# Altium schematic sheet CANOPi_Topboard_Pi.SchDoc
size A3; DocumentNumber: 1; SheetNumber: 1; SheetTotal: 2; CopyrightYear: 2021
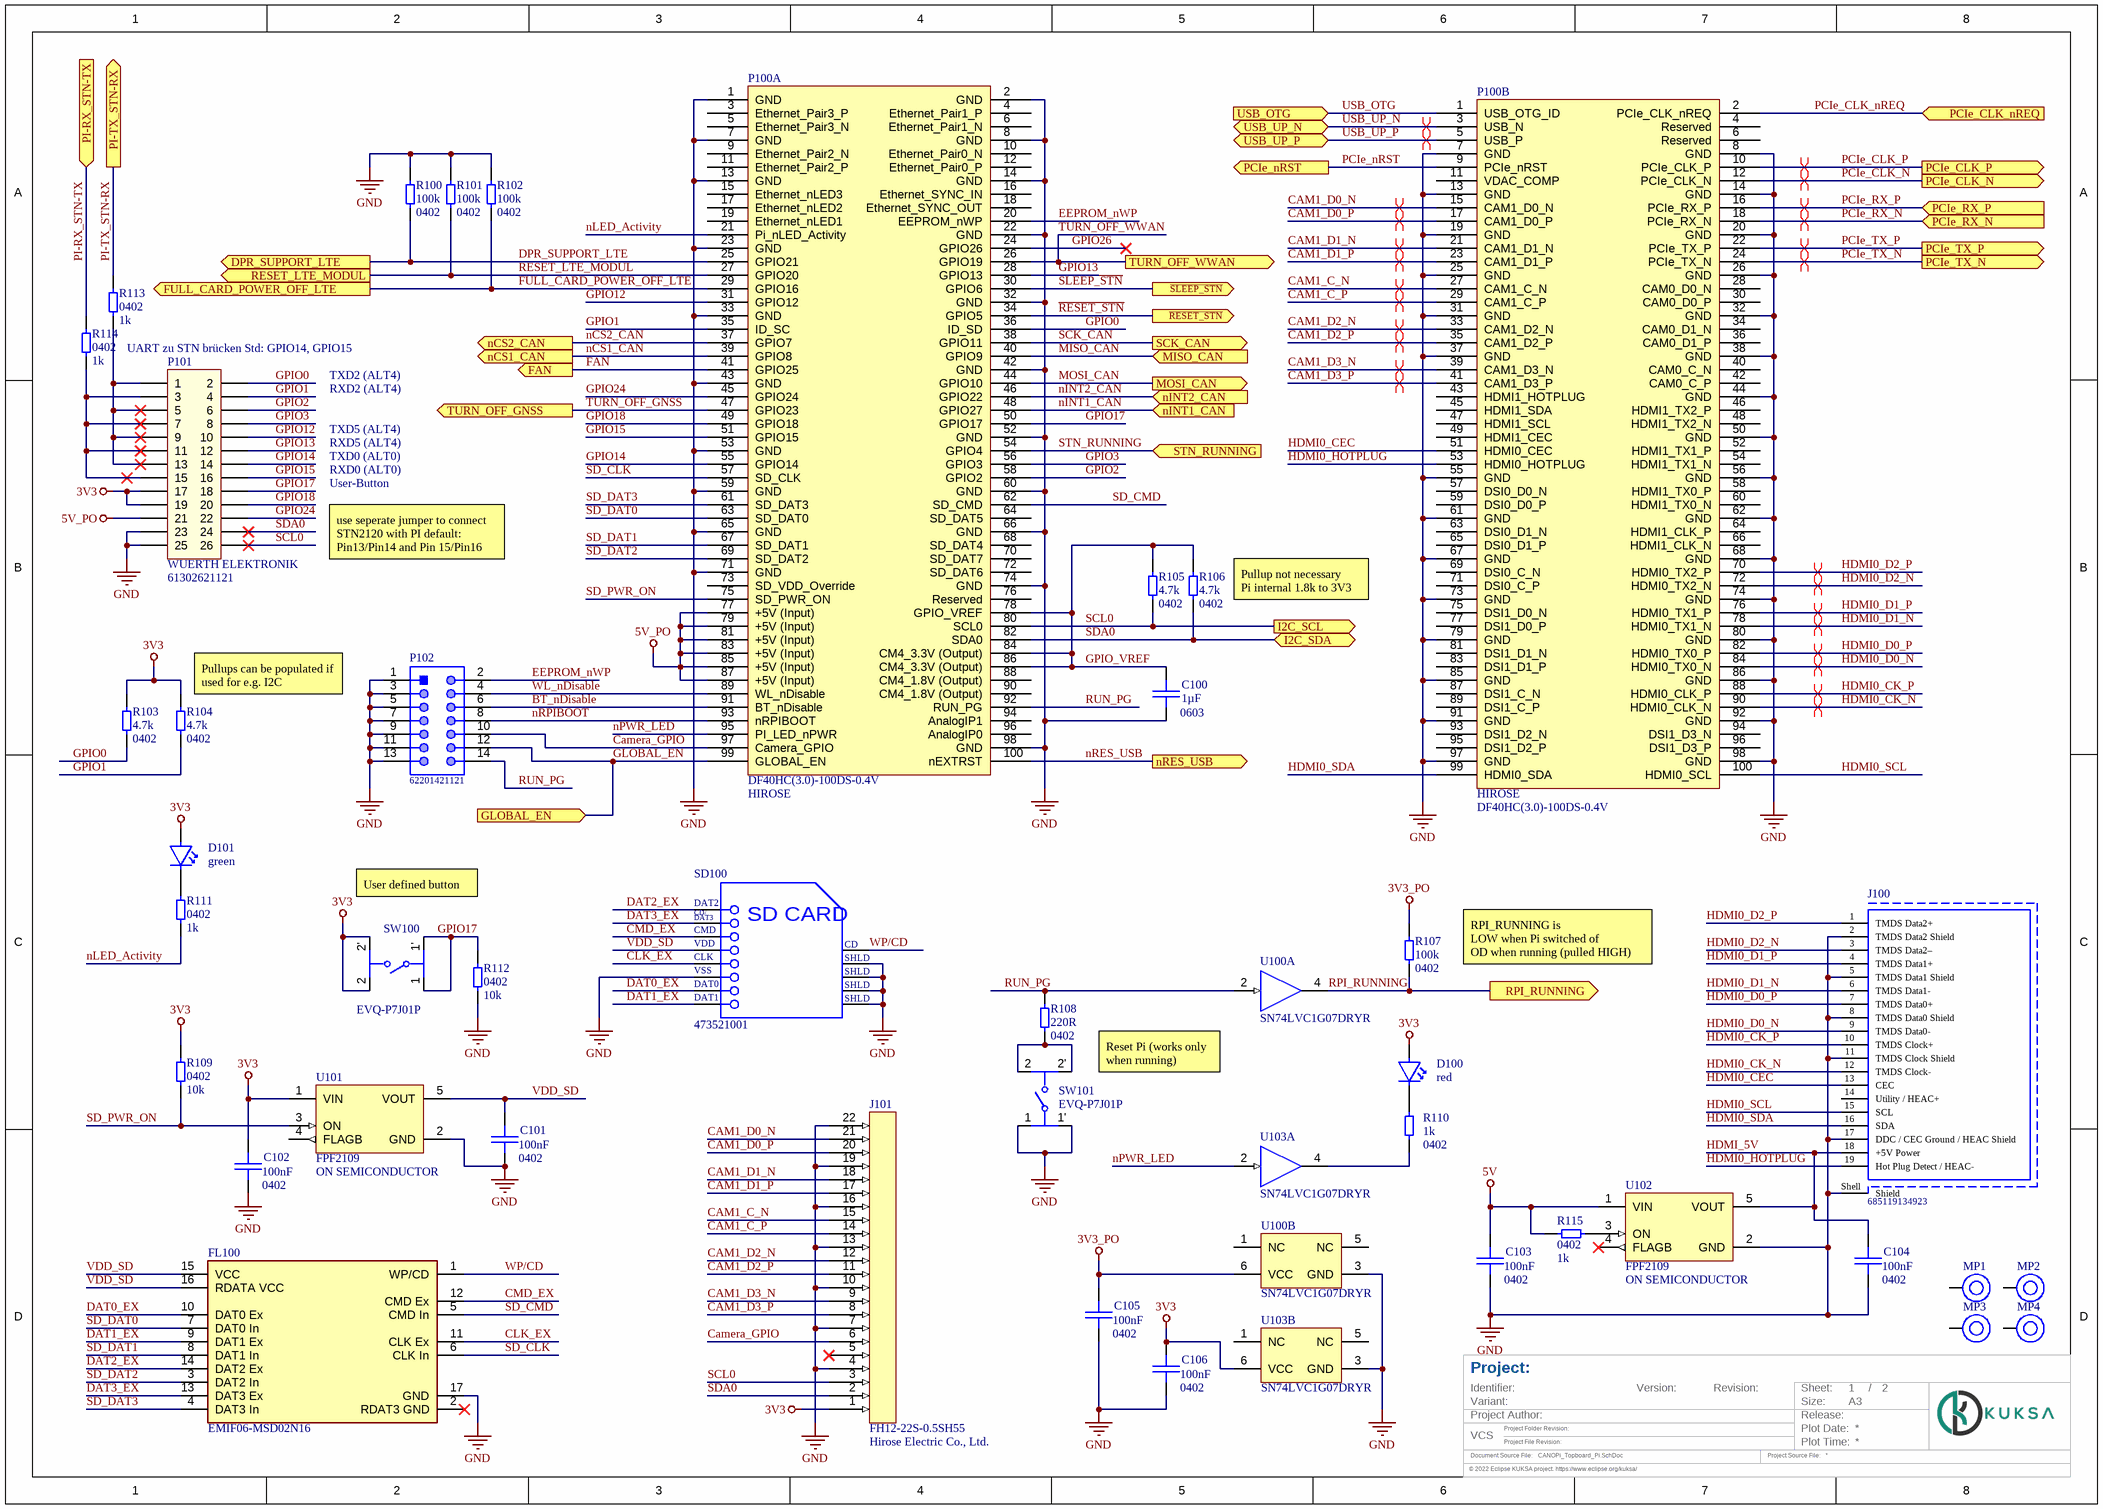
[diagram p0: CANOPi_Topboard_Pi.SchDoc]

## Parts
C100  Capacitance: 1µF  Case: 0603  [CAP 0603 [1608 Metric] X080 N]  (hidden comment: CAP 0603 1u -10% +10% 10V X7R)
C101  Capacitance: 100nF  Case: 0402  [CAP 0402 [1005 Metric] X050 N]  (hidden comment: CAP 0402 100n -10% +10% 6.3V X7R)
C102  Capacitance: 100nF  Case: 0402  [CAP 0402 [1005 Metric] X050 N]  (hidden comment: CAP 0402 100n -10% +10% 6.3V X7R)
C103  Capacitance: 100nF  Case: 0402  [CAP 0402 [1005 Metric] X050 N]  (hidden comment: CAP 0402 100n -10% +10% 6.3V X7R)
C104  Capacitance: 100nF  Case: 0402  [CAP 0402 [1005 Metric] X050 N]  (hidden comment: CAP 0402 100n -10% +10% 6.3V X7R)
C105  Capacitance: 100nF  Case: 0402  [CAP 0402 [1005 Metric] X050 N]  (hidden comment: CAP 0402 100n -10% +10% 6.3V X7R)
C106  Capacitance: 100nF  Case: 0402  [CAP 0402 [1005 Metric] X050 N]  (hidden comment: CAP 0402 100n -10% +10% 6.3V X7R)
D100  Colour LED1: red  [WUERTH ELEKTRONIK - WL-SMSW]  (hidden comment: WUERTH ELEKTRONIK - 155124RS73200)
D101  Colour LED1: green  [WUERTH ELEKTRONIK - WL-SMSW]  (hidden comment: WUERTH ELEKTRONIK - 155124VS73200)
FL100  EMIF06-MSD02N16  [FP-EMIF06-MSD02N16-MFG]
J100  685119134923  [685119134923]
J101  Manufacturer Part Number: FH12-22S-0.5SH55  Manufacturer: Hirose Electric Co., Ltd.  [HIROSE - FH12-22S-0.5SH55-Footprint-1]  (hidden comment: HIROSE - FH12-22S-0.5SH55)
MP1  WUERTH ELEKTRONIK - 9774030151  [WUERTH ELEKTRONIK - 9774030151]  (value not drawn)
MP2  WUERTH ELEKTRONIK - 9774030151  [WUERTH ELEKTRONIK - 9774030151]  (value not drawn)
MP3  WUERTH ELEKTRONIK - 9774030151  [WUERTH ELEKTRONIK - 9774030151]  (value not drawn)
MP4  WUERTH ELEKTRONIK - 9774030151  [WUERTH ELEKTRONIK - 9774030151]  (value not drawn)
P100A  Manufacturer Part Number: DF40HC(3.0)-100DS-0.4V  Manufacturer: HIROSE  [HIROSE - DF40HC(3.0)-100DS-0.4V]  (hidden comment: RASPBERRY-PI - Compute Modul 4)
P100B  Manufacturer: HIROSE  Manufacturer Part Number: DF40HC(3.0)-100DS-0.4V  [HIROSE - DF40HC(3.0)-100DS-0.4V]  (hidden comment: RASPBERRY-PI - Compute Modul 4)
P101  Manufacturer: WUERTH ELEKTRONIK  Manufacturer Part Number: 61302621121  [WUERTH ELEKTRONIK - 61302621121]  (hidden comment: WUERTH ELEKTRONIK - 61302621121)
P102  62201421121  [62201421121]
R100  Resistance: 100k  Case: 0402  [RES 0402 [1005 Metric]_N]  (hidden comment: RES 0402 100K 1% 0W0625)
R101  Resistance: 100k  Case: 0402  [RES 0402 [1005 Metric]_N]  (hidden comment: RES 0402 100K 1% 0W0625)
R102  Resistance: 100k  Case: 0402  [RES 0402 [1005 Metric]_N]  (hidden comment: RES 0402 100K 1% 0W0625)
R103  Resistance: 4.7k  Case: 0402  [RES 0402 [1005 Metric]_N]  (hidden comment: RES 0402 4K7 1% 0W0625)
R104  Resistance: 4.7k  Case: 0402  [RES 0402 [1005 Metric]_N]  (hidden comment: RES 0402 4K7 1% 0W0625)
R105  Resistance: 4.7k  Case: 0402  [RES 0402 [1005 Metric]_N]  (hidden comment: RES 0402 4K7 1% 0W0625)
R106  Resistance: 4.7k  Case: 0402  [RES 0402 [1005 Metric]_N]  (hidden comment: RES 0402 4K7 1% 0W0625)
R107  Resistance: 100k  Case: 0402  [RES 0402 [1005 Metric]_N]  (hidden comment: RES 0402 100K 1% 0W0625)
R108  Resistance: 220R  Case: 0402  [RES 0402 [1005 Metric]_N]  (hidden comment: RES 0402 220R 1% 0W0625)
R109  Case: 0402  Resistance: 10k  [RES 0402 [1005 Metric]_N]  (hidden comment: RES 0402 10K 1% 0W0625)
R110  Case: 0402  Resistance: 1k  [RES 0402 [1005 Metric]_N]  (hidden comment: RES 0402 1K 1% 0W0625)
R111  Case: 0402  Resistance: 1k  [RES 0402 [1005 Metric]_N]  (hidden comment: RES 0402 1K 1% 0W0625)
R112  Case: 0402  Resistance: 10k  [RES 0402 [1005 Metric]_N]  (hidden comment: RES 0402 10K 1% 0W0625)
R113  Case: 0402  Resistance: 1k  [RES 0402 [1005 Metric]_N]  (hidden comment: RES 0402 1K 1% 0W0625)
R114  Case: 0402  Resistance: 1k  [RES 0402 [1005 Metric]_N]  (hidden comment: RES 0402 1K 1% 0W0625)
R115  Case: 0402  Resistance: 1k  [RES 0402 [1005 Metric]_N]  (hidden comment: RES 0402 1K 1% 0W0625)
SD100  473521001  [MOLX-473521001_V]
SW100  EVQ-P7J01P  [FP-EVQ-P7J01P-MFG]
SW101  EVQ-P7J01P  [FP-EVQ-P7J01P-MFG]
U100  SN74LVC1G07DRYR  [DRY0006A_V]  (parts A,B of 2)
U101  Manufacturer Part Number: FPF2109  Manufacturer: ON SEMICONDUCTOR  [ON SEMICONDUCTOR - SOT-23, 5 Lead  CASE 527AH-01]  (hidden comment: ON SEMICONDUCTOR - FPF2109)
U102  Manufacturer Part Number: FPF2109  Manufacturer: ON SEMICONDUCTOR  [ON SEMICONDUCTOR - SOT-23, 5 Lead  CASE 527AH-01]  (hidden comment: ON SEMICONDUCTOR - FPF2109)
U103  SN74LVC1G07DRYR  [DRY0006A_V]  (parts A,B of 2)

## Ports
DPR_SUPPORT_LTE (out), FAN (out), FULL_CARD_POWER_OFF_LTE (out), GLOBAL_EN (in), I2C_SCL (out), I2C_SDA (bidir), MISO_CAN (in), MOSI_CAN (out), nCS1_CAN (out), nCS2_CAN (out), nINT1_CAN (in), nINT2_CAN (in), nRES_USB (out), PCIe_CLK_N (out), PCIe_CLK_nREQ (in), PCIe_CLK_P (out), PCIe_nRST (out), PCIe_RX_N (in), PCIe_RX_P (in), PCIe_TX_N (out), PCIe_TX_P (out), PI-RX_STN-TX (in), PI-TX_STN-RX (out), RESET_LTE_MODUL (out), RPI_RUNNING (out), SCK_CAN (out), STN_RUNNING (in), TURN_OFF_GNSS (out), TURN_OFF_WWAN (out), USB_OTG (in), USB_UP_N (bidir), USB_UP_P (bidir), ~{RESET_STN} (out), ~{SLEEP_STN} (out)

## Nets
3V3: C102.2 C106.2 D100.A D101.A J101.1 P101.17 P101.19 R103.2 R104.2 R109.1 SW100.2 SW100.2' U101.1(VIN) U103.6(VCC)
3V3_PO: C105.2 R107.2 U100.6(VCC)
5V: C103.2 R115.2 U102.1(VIN)
5V_PO: P100A.77(+5V_(Input)) P100A.79(+5V_(Input)) P100A.81(+5V_(Input)) P100A.83(+5V_(Input)) P100A.85(+5V_(Input)) P100A.87(+5V_(Input)) P101.21
GND: C100.2 C101.1 C102.1 C103.1 C104.1 C105.1 C106.1 FL100.17(GND) J100.2(TMDS_Data2_Shield) J100.5(TMDS_Data1_Shield) J100.8(TMDS_Data0_Shield) J100.11(TMDS_Clock_Shield) J100.17(DDC_/_CEC_Ground_/_HEAC_Shield) J100.Shell(Shield) J101.4 J101.7 J101.10 J101.13 J101.16 J101.19 J101.22 P100A.1(GND) P100A.2(GND) P100A.7(GND) P100A.8(GND) P100A.13(GND) P100A.14(GND) P100A.22(GND) P100A.23(GND) P100A.32(GND) P100A.33(GND) P100A.42(GND) P100A.43(GND) P100A.52(GND) P100A.53(GND) P100A.59(GND) P100A.60(GND) P100A.65(GND) P100A.66(GND) P100A.71(GND) P100A.74(GND) P100A.98(GND) P100B.7(GND) P100B.8(GND) P100B.13(GND) P100B.14(GND) P100B.19(GND) P100B.20(GND) P100B.25(GND) P100B.26(GND) P100B.31(GND) P100B.32(GND) P100B.37(GND) P100B.38(GND) P100B.44(GND) P100B.50(GND) P100B.55(GND) P100B.56(GND) P100B.61(GND) P100B.62(GND) P100B.67(GND) P100B.68(GND) P100B.73(GND) P100B.74(GND) P100B.79(GND) P100B.80(GND) P100B.85(GND) P100B.86(GND) P100B.91(GND) P100B.92(GND) P100B.97(GND) P100B.98(GND) P101.23 P101.25 P102.1 P102.3 P102.5 P102.7 P102.9 P102.11 P102.13 R100.2 R101.2 R102.2 R112.2 SD100.6(VSS) SD100.10(SHLD) SD100.11(SHLD) SD100.12(SHLD) SD100.13(SHLD) SW101.1 SW101.1' U100.3(GND) U101.2(GND) U102.2(GND) U103.3(GND)
~{RESET_STN}: P100A.34(GPIO5) ; port ~{RESET_STN}
~{SLEEP_STN}: P100A.30(GPIO6) ; port ~{SLEEP_STN}
BT_nDisable: P100A.91(BT_nDisable) P102.6
CAM1_C_N: J101.15 P100B.27(CAM1_C_N)
CAM1_C_P: J101.14 P100B.29(CAM1_C_P)
CAM1_D0_N: J101.21 P100B.15(CAM1_D0_N)
CAM1_D0_P: J101.20 P100B.17(CAM1_D0_P)
CAM1_D1_N: J101.18 P100B.21(CAM1_D1_N)
CAM1_D1_P: J101.17 P100B.23(CAM1_D1_P)
CAM1_D2_N: J101.12 P100B.33(CAM1_D2_N)
CAM1_D2_P: J101.11 P100B.35(CAM1_D2_P)
CAM1_D3_N: J101.9 P100B.39(CAM1_D3_N)
CAM1_D3_P: J101.8 P100B.41(CAM1_D3_P)
Camera_GPIO: J101.6 P100A.97(Camera_GPIO) P102.10
CLK_EX: FL100.11(CLK_Ex) SD100.5(CLK)
CMD_EX: FL100.12(CMD_Ex) SD100.3(CMD)
DAT0_EX: FL100.10(DAT0_Ex) SD100.7(DAT0)
DAT1_EX: FL100.9(DAT1_Ex) SD100.8(DAT1)
DAT2_EX: FL100.14(DAT2_Ex) SD100.1(DAT2)
DAT3_EX: FL100.13(DAT3_Ex) SD100.2(CD/DAT3)
DPR_SUPPORT_LTE: P100A.25(GPIO21) R100.1 ; port DPR_SUPPORT_LTE
EEPROM_nWP: P100A.20(EEPROM_nWP) P102.2
FAN: P100A.41(GPIO25) ; port FAN
FULL_CARD_POWER_OFF_LTE: P100A.29(GPIO16) R102.1 ; port FULL_CARD_POWER_OFF_LTE
GLOBAL_EN: P100A.99(GLOBAL_EN) P102.12 ; port GLOBAL_EN
GPIO0: P100A.36(ID_SD) P101.2 R103.1
GPIO1: P100A.35(ID_SC) P101.4 R104.1
GPIO2: P100A.58(GPIO2) P101.6
GPIO3: P100A.56(GPIO3) P101.8
GPIO12: P100A.31(GPIO12) P101.10
GPIO13: P100A.28(GPIO13) P101.12
GPIO14: P100A.55(GPIO14) P101.14
GPIO15: P100A.51(GPIO15) P101.16
GPIO17: P100A.50(GPIO17) P101.18 R112.1 SW100.1 SW100.1'
GPIO18: P100A.49(GPIO18) P101.20
GPIO24: P100A.45(GPIO24) P101.22
GPIO26: P100A.24(GPIO26)
GPIO_VREF: C100.1 P100A.78(GPIO_VREF) P100A.84(CM4_3.3V_(Output)) P100A.86(CM4_3.3V_(Output)) R105.2 R106.2
HDMI0_CEC: J100.13(CEC) P100B.51(HDMI0_CEC)
HDMI0_CK_N: J100.12(TMDS_Clock-) P100B.90(HDMI0_CLK_N)
HDMI0_CK_P: J100.10(TMDS_Clock+) P100B.88(HDMI0_CLK_P)
HDMI0_D0_N: J100.9(TMDS_Data0-) P100B.84(HDMI0_TX0_N)
HDMI0_D0_P: J100.7(TMDS_Data0+) P100B.82(HDMI0_TX0_P)
HDMI0_D1_N: J100.6(TMDS_Data1-) P100B.78(HDMI0_TX1_N)
HDMI0_D1_P: J100.4(TMDS_Data1+) P100B.76(HDMI0_TX1_P)
HDMI0_D2_N: J100.3(TMDS_Data2–) P100B.72(HDMI0_TX2_N)
HDMI0_D2_P: J100.1(TMDS_Data2+) P100B.70(HDMI0_TX2_P)
HDMI0_HOTPLUG: J100.19(Hot_Plug_Detect_/_HEAC-) P100B.53(HDMI0_HOTPLUG)
HDMI0_SCL: J100.15(SCL) P100B.100(HDMI0_SCL)
HDMI0_SDA: J100.16(SDA) P100B.99(HDMI0_SDA)
HDMI_5V: C104.2 J100.18(+5V_Power) U102.5(VOUT)
MISO_CAN: P100A.40(GPIO9) ; port MISO_CAN
MOSI_CAN: P100A.44(GPIO10) ; port MOSI_CAN
nCS1_CAN: P100A.39(GPIO8) ; port nCS1_CAN
nCS2_CAN: P100A.37(GPIO7) ; port nCS2_CAN
nINT1_CAN: P100A.48(GPIO27) ; port nINT1_CAN
nINT2_CAN: P100A.46(GPIO22) ; port nINT2_CAN
nLED_Activity: P100A.21(Pi_nLED_Activity) R111.1
nPWR_LED: P100A.95(PI_LED_nPWR) U103.2(A)
nRES_USB: P100A.100(nEXTRST) ; port nRES_USB
nRPIBOOT: P100A.93(nRPIBOOT) P102.8
PCIe_CLK_N: P100B.12(PCIe_CLK_N) ; port PCIe_CLK_N
PCIe_CLK_nREQ: P100B.2(PCIe_CLK_nREQ) ; port PCIe_CLK_nREQ
PCIe_CLK_P: P100B.10(PCIe_CLK_P) ; port PCIe_CLK_P
PCIe_nRST: P100B.9(PCIe_nRST) ; port PCIe_nRST
PCIe_RX_N: P100B.18(PCIe_RX_N) ; port PCIe_RX_N
PCIe_RX_P: P100B.16(PCIe_RX_P) ; port PCIe_RX_P
PCIe_TX_N: P100B.24(PCIe_TX_N) ; port PCIe_TX_N
PCIe_TX_P: P100B.22(PCIe_TX_P) ; port PCIe_TX_P
PI-RX_STN-TX: R114.2 ; port PI-RX_STN-TX
PI-TX_STN-RX: R113.2 ; port PI-TX_STN-RX
RESET_LTE_MODUL: P100A.27(GPIO20) R101.1 ; port RESET_LTE_MODUL
RPI_RUNNING: R107.1 U100.4(Y) ; port RPI_RUNNING
RUN_PG: P100A.92(RUN_PG) P102.14 R108.1 U100.2(A)
SCK_CAN: P100A.38(GPIO11) ; port SCK_CAN
SCL0: J101.3 P100A.80(SCL0) P101.26 R105.1 ; port I2C_SCL
SD_CLK: FL100.6(CLK_In) P100A.57(SD_CLK)
SD_CMD: FL100.5(CMD_In) P100A.62(SD_CMD)
SD_DAT0: FL100.7(DAT0_In) P100A.63(SD_DAT0)
SD_DAT1: FL100.8(DAT1_In) P100A.67(SD_DAT1)
SD_DAT2: FL100.3(DAT2_In) P100A.69(SD_DAT2)
SD_DAT3: FL100.4(DAT3_In) P100A.61(SD_DAT3)
SD_PWR_ON: P100A.75(SD_PWR_ON) R109.2 U101.3(ON)
SDA0: J101.2 P100A.82(SDA0) P101.24 R106.1 ; port I2C_SDA
STN_RUNNING: P100A.54(GPIO4) ; port STN_RUNNING
TURN_OFF_GNSS: P100A.47(GPIO23) ; port TURN_OFF_GNSS
TURN_OFF_WWAN: P100A.26(GPIO19) ; port TURN_OFF_WWAN
USB_OTG: P100B.1(USB_OTG_ID) ; port USB_OTG
USB_UP_N: P100B.3(USB_N) ; port USB_UP_N
USB_UP_P: P100B.5(USB_P) ; port USB_UP_P
VDD_SD: C101.2 FL100.15(VCC) FL100.16(RDATA_VCC) SD100.4(VDD) U101.5(VOUT)
WL_nDisable: P100A.89(WL_nDisable) P102.4
WP/CD: FL100.1(WP/CD) SD100.9(CD)
NetD100_C: D100.C R110.2
NetD101_C: D101.C R111.2
NetP101_1: P101.1 P101.5 P101.9 P101.13 R113.1
NetP101_3: P101.3 P101.7 P101.11 P101.15 R114.1
NetR108_2: R108.2 SW101.2 SW101.2'
NetR110_1: R110.1 U103.4(Y)
NetR115_1: R115.1 U102.3(ON)

Not connected (* = marked no-connect by the designer): FL100 2(RDAT3_GND)*; J100 14(Utility_/_HEAC+); J101 5*; MP1 1; MP2 1; MP3 1; MP4 1; P100A 3(Ethernet_Pair3_P) 4(Ethernet_Pair1_P) 5(Ethernet_Pair3_N) 6(Ethernet_Pair1_N) 9(Ethernet_Pair2_N) 10(Ethernet_Pair0_N) 11(Ethernet_Pair2_P) 12(Ethernet_Pair0_P) 15(Ethernet_nLED3) 16(Ethernet_SYNC_IN) 17(Ethernet_nLED2) 18(Ethernet_SYNC_OUT) 19(Ethernet_nLED1) 64(SD_DAT5) 68(SD_DAT4) 70(SD_DAT7) 72(SD_DAT6) 73(SD_VDD_Override) 76(Reserved) 88(CM4_1.8V_(Output)) 90(CM4_1.8V_(Output)) 94(AnalogIP1) 96(AnalogIP0); P100B 4(Reserved) 6(Reserved) 11(VDAC_COMP) 28(CAM0_D0_N) 30(CAM0_D0_P) 34(CAM0_D1_N) 36(CAM0_D1_P) 40(CAM0_C_N) 42(CAM0_C_P) 43(HDMI1_HOTPLUG) 45(HDMI1_SDA) 46(HDMI1_TX2_P) 47(HDMI1_SCL) 48(HDMI1_TX2_N) 49(HDMI1_CEC) 52(HDMI1_TX1_P) 54(HDMI1_TX1_N) 57(DSI0_D0_N) 58(HDMI1_TX0_P) 59(DSI0_D0_P) 60(HDMI1_TX0_N) 63(DSI0_D1_N) 64(HDMI1_CLK_P) 65(DSI0_D1_P) 66(HDMI1_CLK_N) 69(DSI0_C_N) 71(DSI0_C_P) 75(DSI1_D0_N) 77(DSI1_D0_P) 81(DSI1_D1_N) 83(DSI1_D1_P) 87(DSI1_C_N) 89(DSI1_C_P) 93(DSI1_D2_N) 94(DSI1_D3_N) 95(DSI1_D2_P) 96(DSI1_D3_P); U100 1(NC) 5(NC); U101 4(FLAGB); U102 4(FLAGB)*; U103 1(NC) 5(NC)

## Layout directives
differential pair: CAM1_C_N, CAM1_C_P, CAM1_D0_N, CAM1_D0_P, CAM1_D1_N, CAM1_D1_P, CAM1_D2_N, CAM1_D2_P, CAM1_D3_N, CAM1_D3_P, HDMI0_CK_N, HDMI0_CK_P, HDMI0_D0_N, HDMI0_D0_P, HDMI0_D1_N, HDMI0_D1_P, HDMI0_D2_N, HDMI0_D2_P, PCIe_CLK_N, PCIe_CLK_P, PCIe_RX_N, PCIe_RX_P, PCIe_TX_N, PCIe_TX_P, USB_UP_N, USB_UP_P

## Notes on the sheet
- UART zu STN brücken Std: GPIO14, GPIO15
- TXD2 (ALT4)
- RXD2 (ALT4)
- TXD5 (ALT4)
- RXD5 (ALT4)
- TXD0 (ALT0)
- RXD0 (ALT0)
- User-Button
- use seperate jumper to connect STN2120 with PI default:
  Pin13/Pin14 and Pin 15/Pin16
- (near R106) Pullup not necessary
  Pi internal 1.8k to 3V3
- (near R104) Pullups can be populated if used for e.g. I2C
- User defined button
- RPI_RUNNING is
  LOW when Pi switched of
  OD when running (pulled HIGH)
- Reset Pi (works only when running)
- Project:
- Identifier:
- Version:
- Revision:
- Sheet:
- /
- VCS
- Variant:
- Document Source File:
- Project Author:
- Project Folder Revision:
- Project File Revision:
- Project Source File:
- Plot Date:
- Size:
- Plot Time:
- Release:
- A3
- © 2022 Eclipse KUKSA project. https://www.eclipse.org/kuksa/
- Drawn by:
- © Robert Bosch GmbH         . All rights reserved, also regarding any disposal, exploitation, reproduction, editing, distribution, as well as in the event of applications for industrial property rights.
- (in symbol CMP-2000-05848-1) CD/; DAT3; SD CARD

## Library data of the parts
C100 = CMP-02997-5: SMD/SMT 0603 10V -10% +10% X7R - Multilayer Ceramic Capacitors MLCC; Manufacturer Part Number: GRM188R71A105KA61#; Manufacturer: MURATA; Capacitance Tolerance pos: 10%; Value: 1µF; Assembly: yes; IPC Footprint Naming: CAPC1608X080; Voltage Rating: 10V; Mounting Type: SMT; Operating Temperature max: 125°C; Operating Temperature min: -55°C; ComponentLink1Description: Datasheet; Capacitance Tolerance neg: -10%; ComponentLink1URL: http://psearch.en.murata.com/capacitor/lineup/grm/; Dielectric Type: X7R
C101-C106 = CMP-04212-4: SMD/SMT 0402 6.3V -10% +10% X7R - Multilayer Ceramic Capacitors MLCC; Manufacturer: MURATA; Manufacturer Part Number: GRM155R70J104KA01#; Capacitance Tolerance pos: 10%; Value: 100nF; Assembly: yes; Operating Temperature min: -55°C; Voltage Rating: 6.3V; Operating Temperature max: 125°C; ComponentLink1URL: http://psearch.en.murata.com/capacitor/lineup/grm/; IPC Footprint Naming: CAPC1005X050; Capacitance Tolerance neg: -10%; ComponentLink1Description: Datasheet; Dielectric Type: X7R; Mounting Type: SMT
D100 = CMP-11201-1: LED, RED, Right Angle SMD 3.2*1.0mm WL-SMSW SMT Mono-color Side view Waterclear; View Angle: 120°; Wavelength LED1: 470nm; Reverse Voltage LED1: 5V; Forward Voltage LED1: 2V; Luminous Intensity LED1: 150mcd; Forward Current LED1: 25mA; Assembly: yes; Case: 1305; Operating Temperature max: 85°C; ComponentLink1Description: Datahseet; Manufacturer: WUERTH ELEKTRONIK; Operating Temperature min: -40°C; ComponentLink1URL: https://katalog.we-online.de/led/datasheet/155124BS73200.pdf; Mounting Type: SMT; Manufacturer Part Number: 155124RS73200
D101 = CMP-11200-1: LED, GREEN, Right Angle SMD 3.2*1.0mm WL-SMSW SMT Mono-color Side view Waterclear; Forward Current LED1: 25mA; Reverse Voltage LED1: 5V; Assembly: yes; Luminous Intensity LED1: 150mcd; Forward Voltage LED1: 3.4V; Wavelength LED1: 470nm; View Angle: 120°; Operating Temperature min: -40°C; Mounting Type: SMT; Manufacturer: WUERTH ELEKTRONIK; Case: 1305; ComponentLink1URL: https://katalog.we-online.de/led/datasheet/155124BS73200.pdf; Operating Temperature max: 85°C; Manufacturer Part Number: 155124VS73200; ComponentLink1Description: Datahseet
FL100 = CMP-12221-000004-1: FILTER RC(PI) 45 OHM/20PF SMD; Max Breakdown Voltage: 8V; Number of Channels: 6; Capacitance: 20pF; ESD Protection: Yes; Min Operating Temperature: -30°C; Contact Plating: Gold; Width: 0.047inch; Package Quantity: 1; Length: 3.55mm; Mount: Surface Mount; Breakdown Voltage: 8V; Max Operating Temperature: 85°C; REACH SVHC: No SVHC; Radiation Hardening: No; Depth: 1.25mm; Number of Pins: 16; Height: 0.022inch; Termination: Flat; Packaging: Tape and Reel; Case/Package: QFN; Lead Free: Lead Free
J100 = CMP-1502-00169-1: HDMI Type A Receptacle WR-HDMI, Horizontal, SMT; Manufacturer: Wurth Elektronik; Contact Resistance: 30mOhm; Working Voltage: 40VDC; Rated Current: 0.5A; Publisher: WurthElektronik; Datasheet URL: https://katalog.we-online.de/em/datasheet/685119134923.pdf; Gender: Receptacle; Manufacturer URL: http://www.we-online.de; Orientation: Horizontal; Mounting Technology: SMT; Part Number: 685119134923; Packaging: TapeandReel; Package Reference: 685119134923; Operating Temperature: -20to85degC; Connector Type: HDMITypeA
J101 = CMP-11225-1: FFC/FPC Steckverbinder, 22 Positionen, unten 0,020" (0,50mm) Oberflächenmontage, rechtwinklig; Gender: Female; Pitch Spacing: 500µm; Current Rating: 500mA; Voltage Rating: 50V; Assembly: yes; Mounting Type: SMT; Operating Temperature min: -40°C; Operating Temperature max: 85°C; ComponentLink1URL: https://www.hirose.com/product/document?clcode=&productname=&series=FH12&documenttype=Catalog&lang=en&documentid=D31648_en; ComponentLink1Description: Manufacturer Link; Number of Pins: 22; Number of Rows: 1
MP1-MP4 = CMP-12569-1: WA-SMSI SMT Steel Spacer with internal Thread, OD 5.1mm, M2.5 x 3mm; Assembly: yes; Operating Temperature min: -55°C; Manufacturer: WUERTH ELEKTRONIK; ComponentLink1URL: https://www.we-online.com/components/products/datasheet/9774030151.pdf; Manufacturer Part Number: 9774030151; Operating Temperature max: 155°C; ComponentLink1Description: Manufacturer Link
P100A = CMP-12565-1: Connector Pin 1-100, Parameters from HIROSE - DF40HC(3.0)-100DS-0.4V; Current Rating: 300mA; Pitch Spacing: 400mm; Gender: Receptacle; Voltage Rating: 30V; Assembly: yes; Operating Temperature max: 85°C; Contact Plating: Au; ComponentLink1Description: Manufacturer Link; Mounting Type: SMT; ComponentLink1URL: https://www.hirose.com/en/product/p/CL0684-4151-0-51; Operating Temperature min: -35°C; Number of Rows: 2; Number of Pins: 100
P100B = CMP-12566-2: Connector Pin 101-200, Parameters from HIROSE - DF40HC(3.0)-100DS-0.4V; Assembly: yes; Current Rating: 300mA; Pitch Spacing: 400mm; Gender: Receptacle; Voltage Rating: 30V; ComponentLink1URL: https://www.hirose.com/en/product/p/CL0684-4151-0-51; ComponentLink1Description: Manufacturer Link; Operating Temperature min: -35°C; Number of Rows: 2; Operating Temperature max: 85°C; Number of Pins: 100; Mounting Type: SMT; Contact Plating: Au
P101 = CMP-05158-2: 26 pin 2.54MM DUAL PIN HEADER; Assembly: yes; Current Rating: 3A; Gender: male; Pitch Spacing: 2,54mm; Voltage Rating: 250V; ComponentLink1Description: Datasheet; Mounting Type: THT; Number of Pins: 26; Number of Rows: 2; Operating Temperature max: 105°C; Operating Temperature min: -40°C; Case: 26pin 2.54mm dual-row pin header; ComponentLink1URL: http://katalog.we-online.de/em/datasheet/6130xx21121.pdf; Contact Plating: gold
P102 = CMP-1502-00949-1: THT Vertical Pin Header WR-PHD, Pitch 1.27 mm, Dual Row, 14 pins; Manufacturer: Wurth Elektronik; Pin Number: 14; Withstanding Voltage: 500VAC; Rated Current: 1A; Working Voltage: 100VAC; Pitch: 1.27mm; Gender: Male; Contact Resistance: 20mOhm; Packaging: Box; Operating Temperature: -40to105degC; Part Number: 62201421121; Publisher: WurthElektronik; Datasheet URL: https://katalog.we-online.de/em/datasheet/62201421121.pdf; Manufacturer URL: http://www.we-online.de; Package Reference: 62201421121; Mounting Technology: THT; Orientation: Vertical; Row Number: Dual
R100-R102 R107 = CMP-01074-5: RC0402 series chip resistor with lead-free terminations made by thick film process; Manufacturer Part Number: RC0402FR-07100KL; Manufacturer: YAGEO; Temperature Coefficient: ±100ppm/K; Current Rating: 1A; Assembly: yes; Power Rating: 62.5mW; Voltage Rating: 50V; Mounting Type: SMT; ComponentLink1URL: http://www.yageo.com/documents/recent/PYu-RC0402_51_RoHS_L_6.pdf; Operating Temperature max: 155°C; Operating Temperature min: -55°C; Resistor Element Type: Thick Film; IPC Footprint Naming: RESC1005X04; ComponentLink1Description: Datasheet; Value: 100k; Resistance Tolerance: 1%
R103-R106 = CMP-00920-7: RC0402 series chip resistor with lead-free terminations made by thick film process; Manufacturer Part Number: RC0402FR-074K7L; Manufacturer: YAGEO; Value: 4.7k; Power Rating: 62.5mW; Assembly: yes; Voltage Rating: 50V; Current Rating: 1A; Temperature Coefficient: ±100ppm/K; ComponentLink1URL: https://www.yageo.com/upload/media/product/productsearch/datasheet/rchip/PYu-RC_Group_51_RoHS_L_10.pdf; Operating Temperature max: 155°C; IPC Footprint Naming: RESC1005X04; Resistor Element Type: Thick Film; Mounting Type: SMT; Operating Temperature min: -55°C; ComponentLink1Description: Datasheet; Resistance Tolerance: 1%
R108 = CMP-00765-5: RC0402 series chip resistor with lead-free terminations made by thick film process; Manufacturer: YAGEO; Manufacturer Part Number: RC0402FR-07220RL; Power Rating: 62.5mW; Current Rating: 1A; Value: 220; Temperature Coefficient: ±100ppm/K; Assembly: yes; Voltage Rating: 50V; Operating Temperature min: -55°C; ComponentLink1URL: http://www.yageo.com/documents/recent/PYu-RC0402_51_RoHS_L_6.pdf; Resistance Tolerance: 1%; Resistor Element Type: Thick Film; ComponentLink1Description: Datasheet; Mounting Type: SMT; Operating Temperature max: 155°C; IPC Footprint Naming: RESC1005X04
R109 R112 = CMP-00958-6: RC0402 series chip resistor with lead-free terminations made by thick film process; Manufacturer Part Number: RC0402FR-0710KL; Manufacturer: YAGEO; Voltage Rating: 50V; Temperature Coefficient: ±100ppm/K; Assembly: yes; Current Rating: 1A; Power Rating: 62.5mW; Resistance Tolerance: 1%; Value: 10k; Resistor Element Type: Thick Film; ComponentLink1Description: Datasheet; IPC Footprint Naming: RESC1005X04; Mounting Type: SMT; ComponentLink1URL: http://www.yageo.com/documents/recent/PYu-RC0402_51_RoHS_L_6.pdf; Operating Temperature min: -55°C; Operating Temperature max: 155°C
R110 R111 R113-R115 = CMP-00843-5: RC0402 series chip resistor with lead-free terminations made by thick film process; Manufacturer Part Number: RC0402FR-071KL; Manufacturer: YAGEO; Power Rating: 62.5mW; Current Rating: 1A; Temperature Coefficient: ±100ppm/K; Voltage Rating: 50V; Assembly: yes; Resistance Tolerance: 1%; ComponentLink1URL: http://www.yageo.com/documents/recent/PYu-RC0402_51_RoHS_L_6.pdf; Mounting Type: SMT; Value: 1k; Operating Temperature min: -55°C; ComponentLink1Description: Datasheet; IPC Footprint Naming: RESC1005X04; Operating Temperature max: 155°C; Resistor Element Type: Thick Film
SD100 = CMP-2000-05848-1: MicroSD(TM), Pitch 1.1 mm, 8 Position, Height 1.88 mm, -20 to 85 degC, RoHS, Tape and Reel; Manufacturer: Molex; Datasheet Version: Rev. G, 01/2012; Datasheet URL: http://www.molex.com/pdm_docs/sd/473521001_sd.pdf; Package Reference: 473521001; Manufacturer URL: http://www.molex.com/; Mounting Technology: SurfaceMount; Package Description: MicroSD(TM), Pitch 1.1 mm, 8 Position, Height 1.88 mm
SW100 SW101 = CMP-05618-000001-1: SWITCH TACTILE SPST-NO 0.05A 12V; Manufacturer: Panasonic; Operating Force: 1.6N; Contact Current Rating: 50mA; Electromechanical Life: 100000Cycles; Contact Resistance: 500mΩ; Height: 1.55mm; Temperature Range Low: -20°C; Device Class L1: Electromechanical; Package: 0; RoHS: TRUE; Category: Switch; ComponentLink2Description: Datasheet; Device Class L2: Switches; Temperature Range High: +70°C; Mount: Surface Mount; Device Class L3: Tactile Switches; Temperature: -20°C to +70°C; Automotive: No; Manufacturer Part Number: EVQ-P7J01P; Mouser Description: Tactile Switches 3.5x2.9mm Right Ang Light Touch Switch; ComponentLink2URL: https://b2b-api.panasonic.eu/file_stream/pids/fileversion/2431; Lead Free: Yes; Octopart: https://octopart.com/evq-p7j01p-panasonic-29917078; Digikey Description: SWITCH TACTILE SPST-NO 0.05A 12V; Voltage Rating Dc: 12V; Throw Configuration: SPST-NO
U100 U103 = CMP-0859-00833-3: Single Buffer/Driver With Open-Drain Output, DRY0006A, LARGE T&R; Manufacturer: Texas Instruments; Sub-Family: Non-Inverting Buffer/Driver; Output Type: CMOS; Bits(#): 1; Schmitt Trigger: No; Output Drive (IOL/IOH)(Max)(mA): 32/-32; ICC @ Nom Voltage(Max)(mA): 0.01; Technology Family: LVC; Rating: Catalog; VCC(Min)(V): 1.65; tpd @ Nom Voltage(Max)(ns): 8.6,6,4.7,4; VCC(Max)(V): 5.5; F @ Nom Voltage(Max)(Mhz): 150; Logic: True; Input Type: CMOS/TTL; Voltage(Nom)(V): 1.8,2.5,3.3,5; Operating Temperature Range(C): -40 to 125,-40 to 85; DatasheetVersion: SCES296AC; Generic Part Number: SN74LVC1G07; PackageReference: DRY0006A; 3-State Output: No; PartId: 1
U101 U102 = CMP-11156-1: The  FPF2108-FPF2110  is  a  series  of  load  switches  whichprovides   full   protection   to   systems   and   loads   which   mayencounter  large  current  conditions.; No. of Outputs: 1; Assembly: yes; Input Voltage max: 5,5V; Input Voltage min: 1,8V; Output Current max: 400mA; ComponentLink1URL: https://www.mouser.de/datasheet/2/308/1/FPF2110_D-2313671.pdf; Operating Temperature min: -40°C; ComponentLink1Description: Manufacturer Link; Operating Temperature max: 125°C; Mounting Type: SMT; Case: SOT23-5